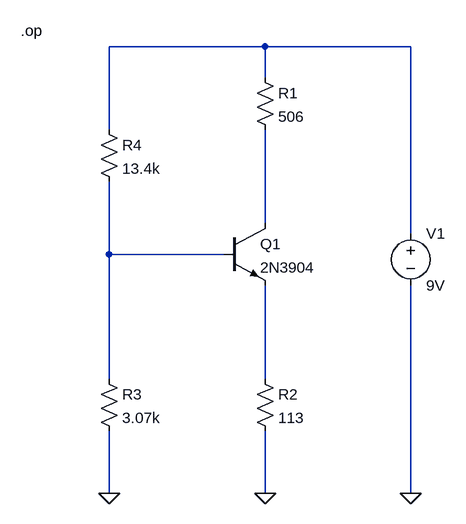
[diagram p0: schematic denryubias.asc]
denryubias.asc, the LTspice schematic file:
Version 4
SHEET 1 880 680
WIRE 128 -144 -112 -144
WIRE 352 -144 128 -144
WIRE 128 -96 128 -144
WIRE -112 -16 -112 -144
WIRE 128 128 128 -16
WIRE 352 144 352 -144
WIRE -112 176 -112 64
WIRE 64 176 -112 176
WIRE -112 368 -112 176
WIRE 128 368 128 224
WIRE -112 544 -112 448
WIRE 128 544 128 448
WIRE 352 544 352 224
FLAG 352 544 0
FLAG -112 544 0
FLAG 128 544 0
DATAFLAG -16 208 "Ib(Q1)"
DATAFLAG -112 288 "I(R3)"
DATAFLAG -112 -64 "I(R4)"
DATAFLAG 128 32 ""
DATAFLAG 224 64 "I(R1)"
DATAFLAG 208 352 "I(R2)"
DATAFLAG -16 176 ""
DATAFLAG 128 272 ""
SYMBOL voltage 352 128 R0
SYMATTR InstName V1
SYMATTR Value 9V
SYMBOL npn 64 128 R0
SYMATTR InstName Q1
SYMATTR Value 2N3904
SYMBOL res 112 -112 R0
SYMATTR InstName R1
SYMATTR Value 506
SYMBOL res 112 352 R0
SYMATTR InstName R2
SYMATTR Value 113
SYMBOL res -128 352 R0
SYMATTR InstName R3
SYMATTR Value 3.07k
SYMBOL res -128 -32 R0
SYMATTR InstName R4
SYMATTR Value 13.4k
TEXT -248 -168 Left 2 !.op

The netlist it stands for:
* denryubias.asc
V1 N001 0 9V
Q1 N002 N003 N004 0 2N3904
R1 N001 N002 506
R2 N004 0 113
R3 N003 0 3.07k
R4 N001 N003 13.4k
.model NPN NPN
.model PNP PNP
.lib standard.bjt
.op
.backanno
.end